# EAGLE design Impedance_Analyzer (EAGLE 9.5.2)
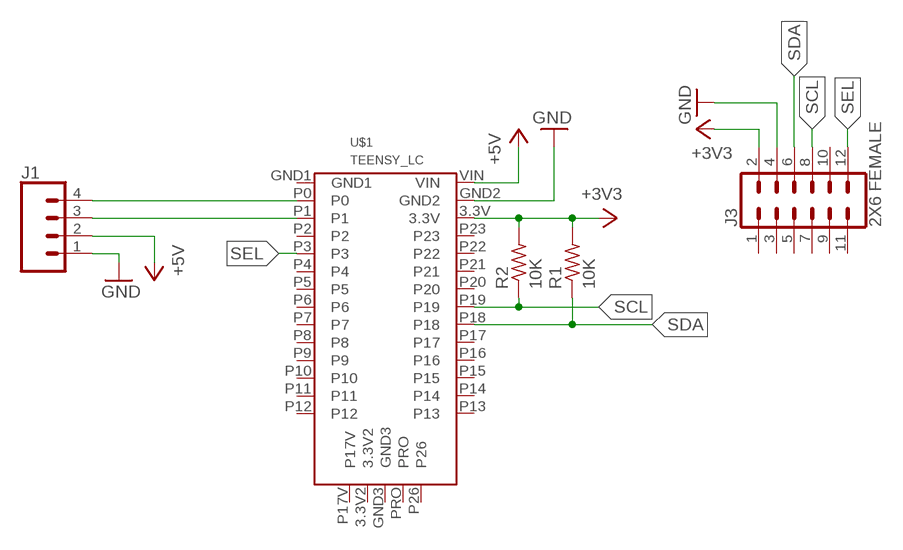
[diagram p0: schematic, sheet 1]

## Parts
J1  CONN_04  [1X04]
J3  2X6 FEMALE  CONN_06X2PTH_FEMALE  [2X6]
R1  10K  R-US_0204/5  [0204/5]
R2  10K  R-US_0204/5  [0204/5]
U$1  TEENSY_LC  [TEENSY_LC]

## Nets
+3V3: J3.2 R1.2 R2.2 U$1.3.3V
+5V: J1.2 U$1.VIN
GND: J1.1 J3.4 U$1.GND2
RX: J1.4 U$1.P0
SCL: J3.8 R2.1 U$1.P19
SDA: J3.6 R1.1 U$1.P18
SEL: J3.12 U$1.P3
TX: J1.3 U$1.P1
Unconnected: J3.1 J3.3 J3.5 J3.7 J3.9 J3.10 J3.11 U$1.3.3V2 U$1.GND1 U$1.GND3 U$1.P2 U$1.P4 U$1.P5 U$1.P6 U$1.P7 U$1.P8 U$1.P9 U$1.P10 U$1.P11 U$1.P12 U$1.P13 U$1.P14 U$1.P15 U$1.P16 U$1.P17 U$1.P17V U$1.P20 U$1.P21 U$1.P22 U$1.P23 U$1.P26 U$1.PRO

## Library data of the parts
J1 = SparkFun-Connectors:CONN_04: Multi connection point. Often used as Generic Header-pin footprint for 0.1 inch spaced/style header connections On any of the 0.1 inch spaced packages, you can populate with these: Break Away Headers - Straight <https://www.sparkfun.com/products/116> (PRT-00116) Break Away Male Headers - Right Angle <https://www.sparkfun.com/products/553> (PRT-00553) Female Headers <https://www.sparkfun.com/products/115> (PRT-00115) Break Away Headers - Machine Pin <https://www.sparkfun.com/products/117> (PRT-00117) Break Away Female Headers - Swiss Machine Pin <https://www.sparkfun.com/products/743> (PRT-00743) For SCREWTERMINALS and SPRING TERMINALS visit here: Screw Terimnals on SparkFun.com <https://www.sparkfun.com/search/results?term=Screw+Terminals> (5mm/3.5mm/2.54mm spacing) This device is also useful as a general connection point to wire up your design to another part of your project. Our various solder wires solder well into these plated through hole pads. Hook-Up Wire - Assortment (Stranded, 22 AWG) <https://www.sparkfun.com/products/11375> (PRT-11375) Hook-Up Wire - Assortment (Solid Core, 22 AWG) <https://www.sparkfun.com/products/11367> (PRT-11367) View the entire wire category on our website here <https://www.sparkfun.com/categories/141> Special notes: Molex polarized connector foot print use with SKU : PRT-08231 with associated crimp pins and housings. 1MM SMD Version SKU: PRT-10208; PROD_ID: CONN-09696
J3 = SparkFun-Connectors:CONN_06X2: Multi connection point. Often used as Generic Header-pin footprint for 0.1 inch spaced/style header connections On any of the 0.1 inch spaced packages, you can populate with these: Break Away Headers - Straight <https://www.sparkfun.com/products/116> (PRT-00116) Break Away Male Headers - Right Angle <https://www.sparkfun.com/products/553> (PRT-00553) Female Headers <https://www.sparkfun.com/products/115> (PRT-00115) Break Away Headers - Machine Pin <https://www.sparkfun.com/products/117> (PRT-00117) Break Away Female Headers - Swiss Machine Pin <https://www.sparkfun.com/products/743> (PRT-00743); PROD_ID: CONN-12423
R1 R2 = adafruit:R-US_: RESISTOR, American symbol
U$1 = Impedance_Analyzer:TEENSY_LC

## Board
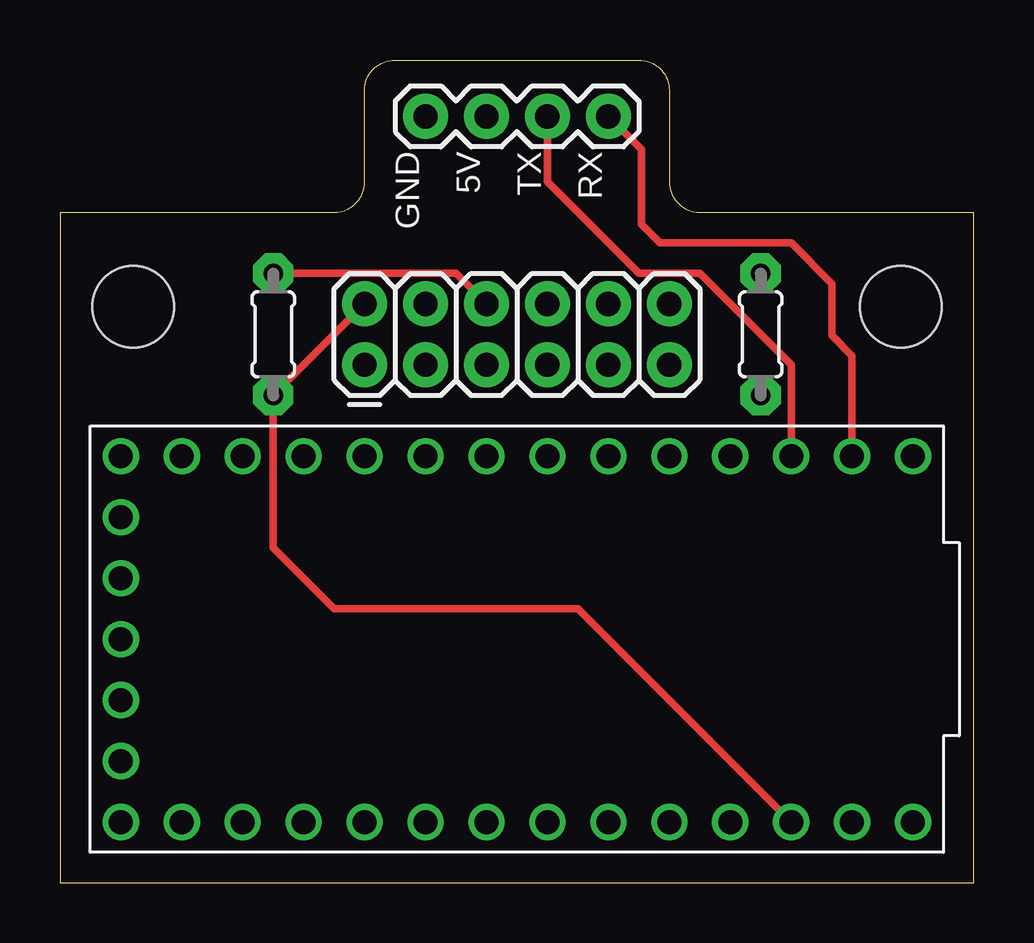
[diagram p1: board, top side]
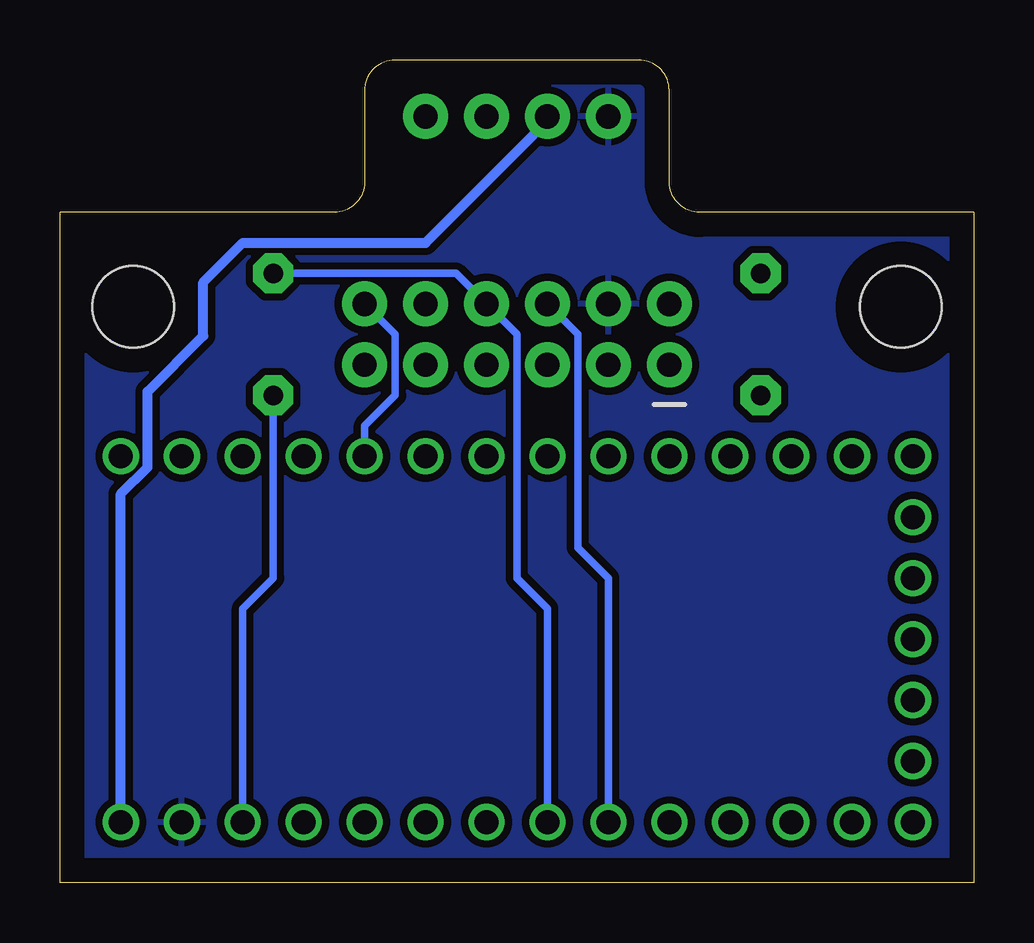
[diagram p2: board, bottom side, seen from below]

Size 38.1 x 34.29 mm. Coordinates in mm from the lower left corner, seen from the top.
Outline: 0,0 38.1,0 38.1,27.94 26.67,27.94 arc-90 25.4,29.21 25.4,33.02 arc90 24.13,34.29 13.97,34.29 arc90 12.7,33.02 12.7,29.21 arc-90 11.43,27.94 0,27.94 0,0
Copper layers (1*16): Top 0.035mm / dielectric 1.5mm / Bottom 0.035mm
Design rules "default *": minimum track width 6mil, minimum drill 0.35mm, track to track 12mil, track to pad 10mil, pad to pad 12mil, via to via 12mil, smd to smd 6mil, copper to edge 40mil, drill to drill 6mil, minimum pad ring 10mil, minimum via ring 8mil, stop-mask expansion 4mil, vias tented up to drill 0mil, thermal gap 10mil
Holes 3.4 mm at 3.05,24 35.05,24

### Footprints (pad centres in the part's own frame; a part is rotated, then mirrored left to right if it is on the bottom)
1X04 = drill 1.016 pad 1.88: 1 0,0; 2 2.54,0; 3 5.08,0; 4 7.62,0
2X6 = drill 1.016 pad 1.88: 1 0,0; 2 0,2.54; 3 2.54,0; 4 2.54,2.54; 5 5.08,0; 6 5.08,2.54; 7 7.62,0; 8 7.62,2.54; 9 10.16,0; 10 10.16,2.54; 11 12.7,0; 12 12.7,2.54
0204/5 = drill 0.813 pad 1.676 octagon: 1 -2.54,0; 2 2.54,0
TEENSY_LC = drill 1: 3.3V 7.62,12.7; 3.3V2 -2.54,-15.24; GND1 -7.62,17.78; GND2 7.62,15.24; GND3 0,-15.24; P0 -7.62,15.24; P1 -7.62,12.7; P2 -7.62,10.16; P3 -7.62,7.62; P4 -7.62,5.08; P5 -7.62,2.54; P6 -7.62,0; P7 -7.62,-2.54; P8 -7.62,-5.08; P9 -7.62,-7.62; P10 -7.62,-10.16; P11 -7.62,-12.7; P12 -7.62,-15.24; P13 7.62,-15.24; P14 7.62,-12.7; P15 7.62,-10.16; P16 7.62,-7.62; P17 7.62,-5.08; P17V -5.08,-15.24; P18 7.62,-2.54; P19 7.62,0; P20 7.62,2.54; P21 7.62,5.08; P22 7.62,7.62; P23 7.62,10.16; P26 5.08,-15.24; PRO 2.54,-15.24; VIN 7.62,17.78

### Placement (x,y rotation side)
J1  15.24,31.94 0 top
J3  12.7,21.59 0 top
R1  8.89,22.86 270 top
R2  29.21,22.86 270 top
U$1  17.78,10.16 270 top

### Tracks (layer width: path | path; a pad name or v marks a point on that pad's centre or on a via)
+3V3
  Top 0.305: U$1.3.3V 21.59,11.43 11.43,11.43 8.89,13.97 R1.2 J3.2
  Bottom 0.305: U$1.3.3V 30.48,11.43 29.21,12.7 R2.2
+5V
  Bottom 0.406: U$1.VIN 35.56,16.21 34.45,17.32 34.45,20.47 32.13,22.79 32.13,25.02 30.48,26.67 22.86,26.67 17.78,31.75 J1.2
GND
  pour Bottom: -1.27,35.56 39.37,35.56 39.37,-1.27 -1.27,-1.27
RX
  Top 0.305: J1.4 24.23,30.57 24.23,27.46 25.02,26.67 30.48,26.67 32.18,24.97 32.18,22.81 33.02,21.97 U$1.P0
SCL
  Bottom 0.305: U$1.P19 17.78,11.43 19.05,12.7 19.05,22.86 J3.8 21.59,25.4 R2.1
SDA
  Top 0.305: R1.1 16.51,25.4 J3.6
  Bottom 0.305: U$1.P18 15.24,12.7 16.51,13.97 16.51,22.86 J3.6
SEL
  Bottom 0.305: U$1.P3 25.4,19.05 24.13,20.32 24.13,22.86 J3.12
TX
  Top 0.305: U$1.P1 30.48,21.59 26.67,25.4 24.13,25.4 20.32,29.21 J1.3

### Text on the board
tPlace: GND | 5V | TX | RX